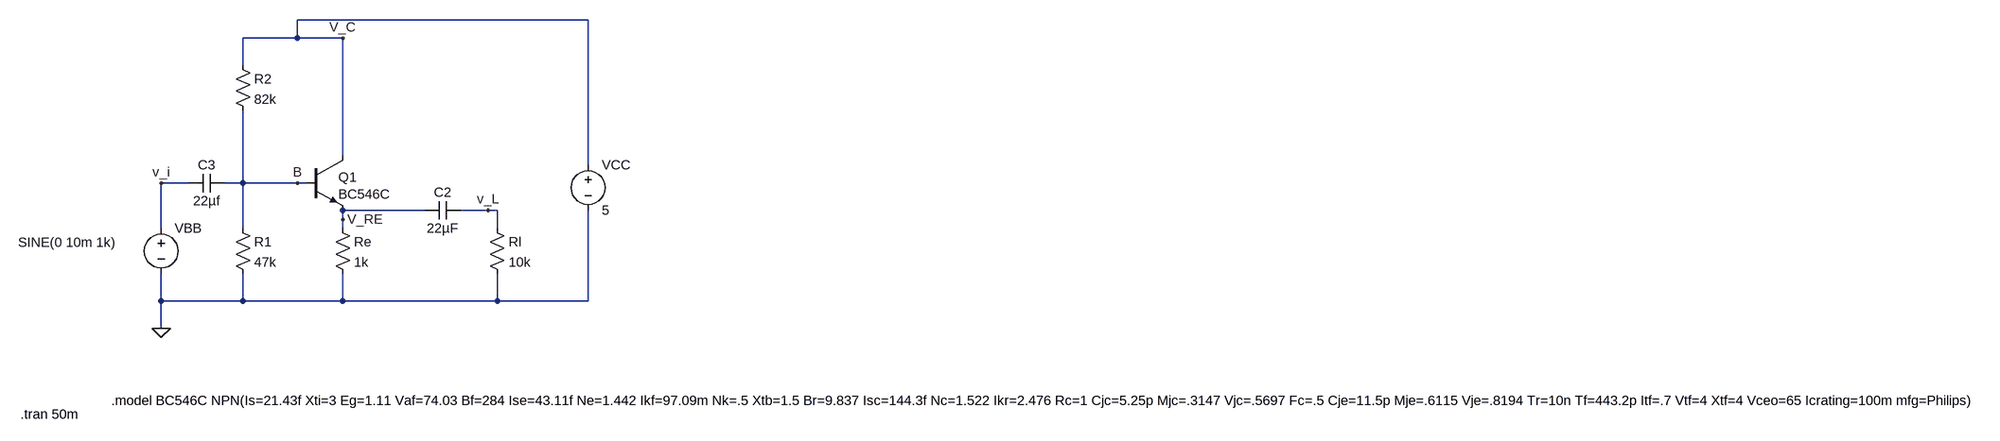
[diagram p0: schematic ValoresComerciales.asc]
ValoresComerciales.asc, the LTspice schematic file:
Version 4.1
SHEET 1 3552 680
WIRE 704 -128 192 -128
WIRE 192 -96 192 -128
WIRE 192 -96 96 -96
WIRE 272 -96 192 -96
WIRE 96 -48 96 -96
WIRE 272 112 272 -96
WIRE 704 128 704 -128
WIRE 0 160 -48 160
WIRE 96 160 96 32
WIRE 96 160 64 160
WIRE 192 160 96 160
WIRE 208 160 192 160
WIRE 416 208 272 208
WIRE 528 208 480 208
WIRE 544 208 528 208
WIRE 272 224 272 208
WIRE -48 240 -48 160
WIRE 96 240 96 160
WIRE 272 240 272 224
WIRE 544 240 544 208
WIRE -48 368 -48 320
WIRE 96 368 96 320
WIRE 96 368 -48 368
WIRE 272 368 272 320
WIRE 272 368 96 368
WIRE 544 368 544 320
WIRE 544 368 272 368
WIRE 704 368 704 208
WIRE 704 368 544 368
WIRE -48 416 -48 368
FLAG 192 160 B
FLAG -48 416 0
FLAG 272 224 V_RE
FLAG 272 -96 V_C
FLAG -48 160 v_i
FLAG 528 208 v_L
SYMBOL npn 208 112 R0
WINDOW 0 56 38 Left 2
SYMATTR InstName Q1
SYMATTR Value BC546C
SYMBOL voltage 704 112 R0
SYMATTR InstName VCC
SYMATTR Value 5
SYMBOL res 256 224 R0
SYMATTR InstName Re
SYMATTR Value 1k
SYMBOL res 80 -64 R0
SYMATTR InstName R2
SYMATTR Value 82k
SYMBOL res 80 224 R0
SYMATTR InstName R1
SYMATTR Value 47k
SYMBOL cap 480 192 R90
WINDOW 0 0 32 VBottom 2
WINDOW 3 32 32 VTop 2
SYMATTR InstName C2
SYMATTR Value 22µF
SYMBOL res 528 224 R0
SYMATTR InstName Rl
SYMATTR Value 10k
SYMBOL voltage -48 224 R0
WINDOW 3 -252 41 Left 2
WINDOW 123 0 0 Left 0
WINDOW 39 0 0 Left 0
SYMATTR Value SINE(0 10m 1k)
SYMATTR InstName VBB
SYMBOL cap 64 144 R90
WINDOW 0 0 32 VBottom 2
WINDOW 3 32 32 VTop 2
SYMATTR InstName C3
SYMATTR Value 22µf
TEXT -136 544 Left 2 !.model BC546C NPN(Is=21.43f Xti=3 Eg=1.11 Vaf=74.03 Bf=284 Ise=43.11f Ne=1.442 Ikf=97.09m Nk=.5 Xtb=1.5 Br=9.837 Isc=144.3f Nc=1.522 Ikr=2.476 Rc=1 Cjc=5.25p Mjc=.3147 Vjc=.5697 Fc=.5 Cje=11.5p Mje=.6115 Vje=.8194 Tr=10n Tf=443.2p Itf=.7 Vtf=4 Xtf=4 Vceo=65 Icrating=100m mfg=Philips)
TEXT -296 568 Left 2 !.tran 50m

The netlist it stands for:
* ValoresComerciales.asc
Q1 V_C B V_RE 0 BC546C
VCC V_C 0 5
Re V_RE 0 1k
R2 V_C B 82k
R1 B 0 47k
C2 v_L V_RE 22µF
Rl v_L 0 10k
VBB v_i 0 SINE(0 10m 1k)
C3 B v_i 22µf
.model NPN NPN
.model PNP PNP
.lib standard.bjt
.model BC546C NPN(Is=21.43f Xti=3 Eg=1.11 Vaf=74.03 Bf=284 Ise=43.11f Ne=1.442 Ikf=97.09m Nk=.5 Xtb=1.5 Br=9.837 Isc=144.3f Nc=1.522 Ikr=2.476 Rc=1 Cjc=5.25p Mjc=.3147 Vjc=.5697 Fc=.5 Cje=11.5p Mje=.6115 Vje=.8194 Tr=10n Tf=443.2p Itf=.7 Vtf=4 Xtf=4 Vceo=65 Icrating=100m mfg=Philips)
.tran 50m
.backanno
.end